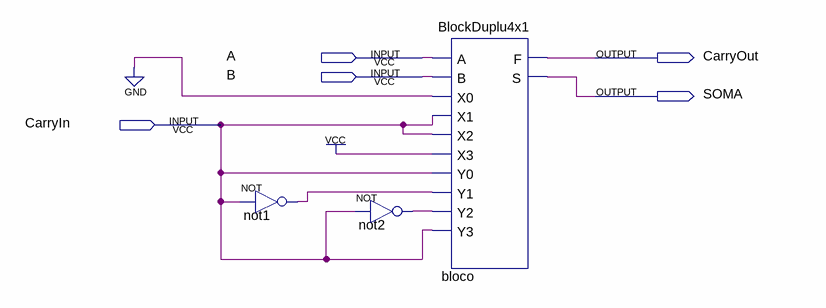
[diagram p0: schematic sheet]
// Quartus schematic experimento6.bdf as structural Verilog: 3 symbols, 5 pins
module experimento6 (
  input  A,
  input  B,
  input  CarryIn,
  output CarryOut,
  output SOMA
);

  wire not1_out, not2_out;

  not not1 (not1_out, CarryIn);
  not not2 (not2_out, CarryIn);
  BlockDuplu4x1 bloco (
    .A(A), .B(B), .X0(1'b0), .X1(CarryIn), .X2(CarryIn), .X3(1'b1), .Y0(CarryIn), .Y1(not1_out),
    .Y2(not2_out), .Y3(CarryIn), .F(CarryOut), .S(SOMA));
endmodule
